# Altium schematic sheet Modules.SchDoc
size A3; DocumentNumber: 3; Revision: V1.0; SheetNumber: 3; SheetTotal: 3
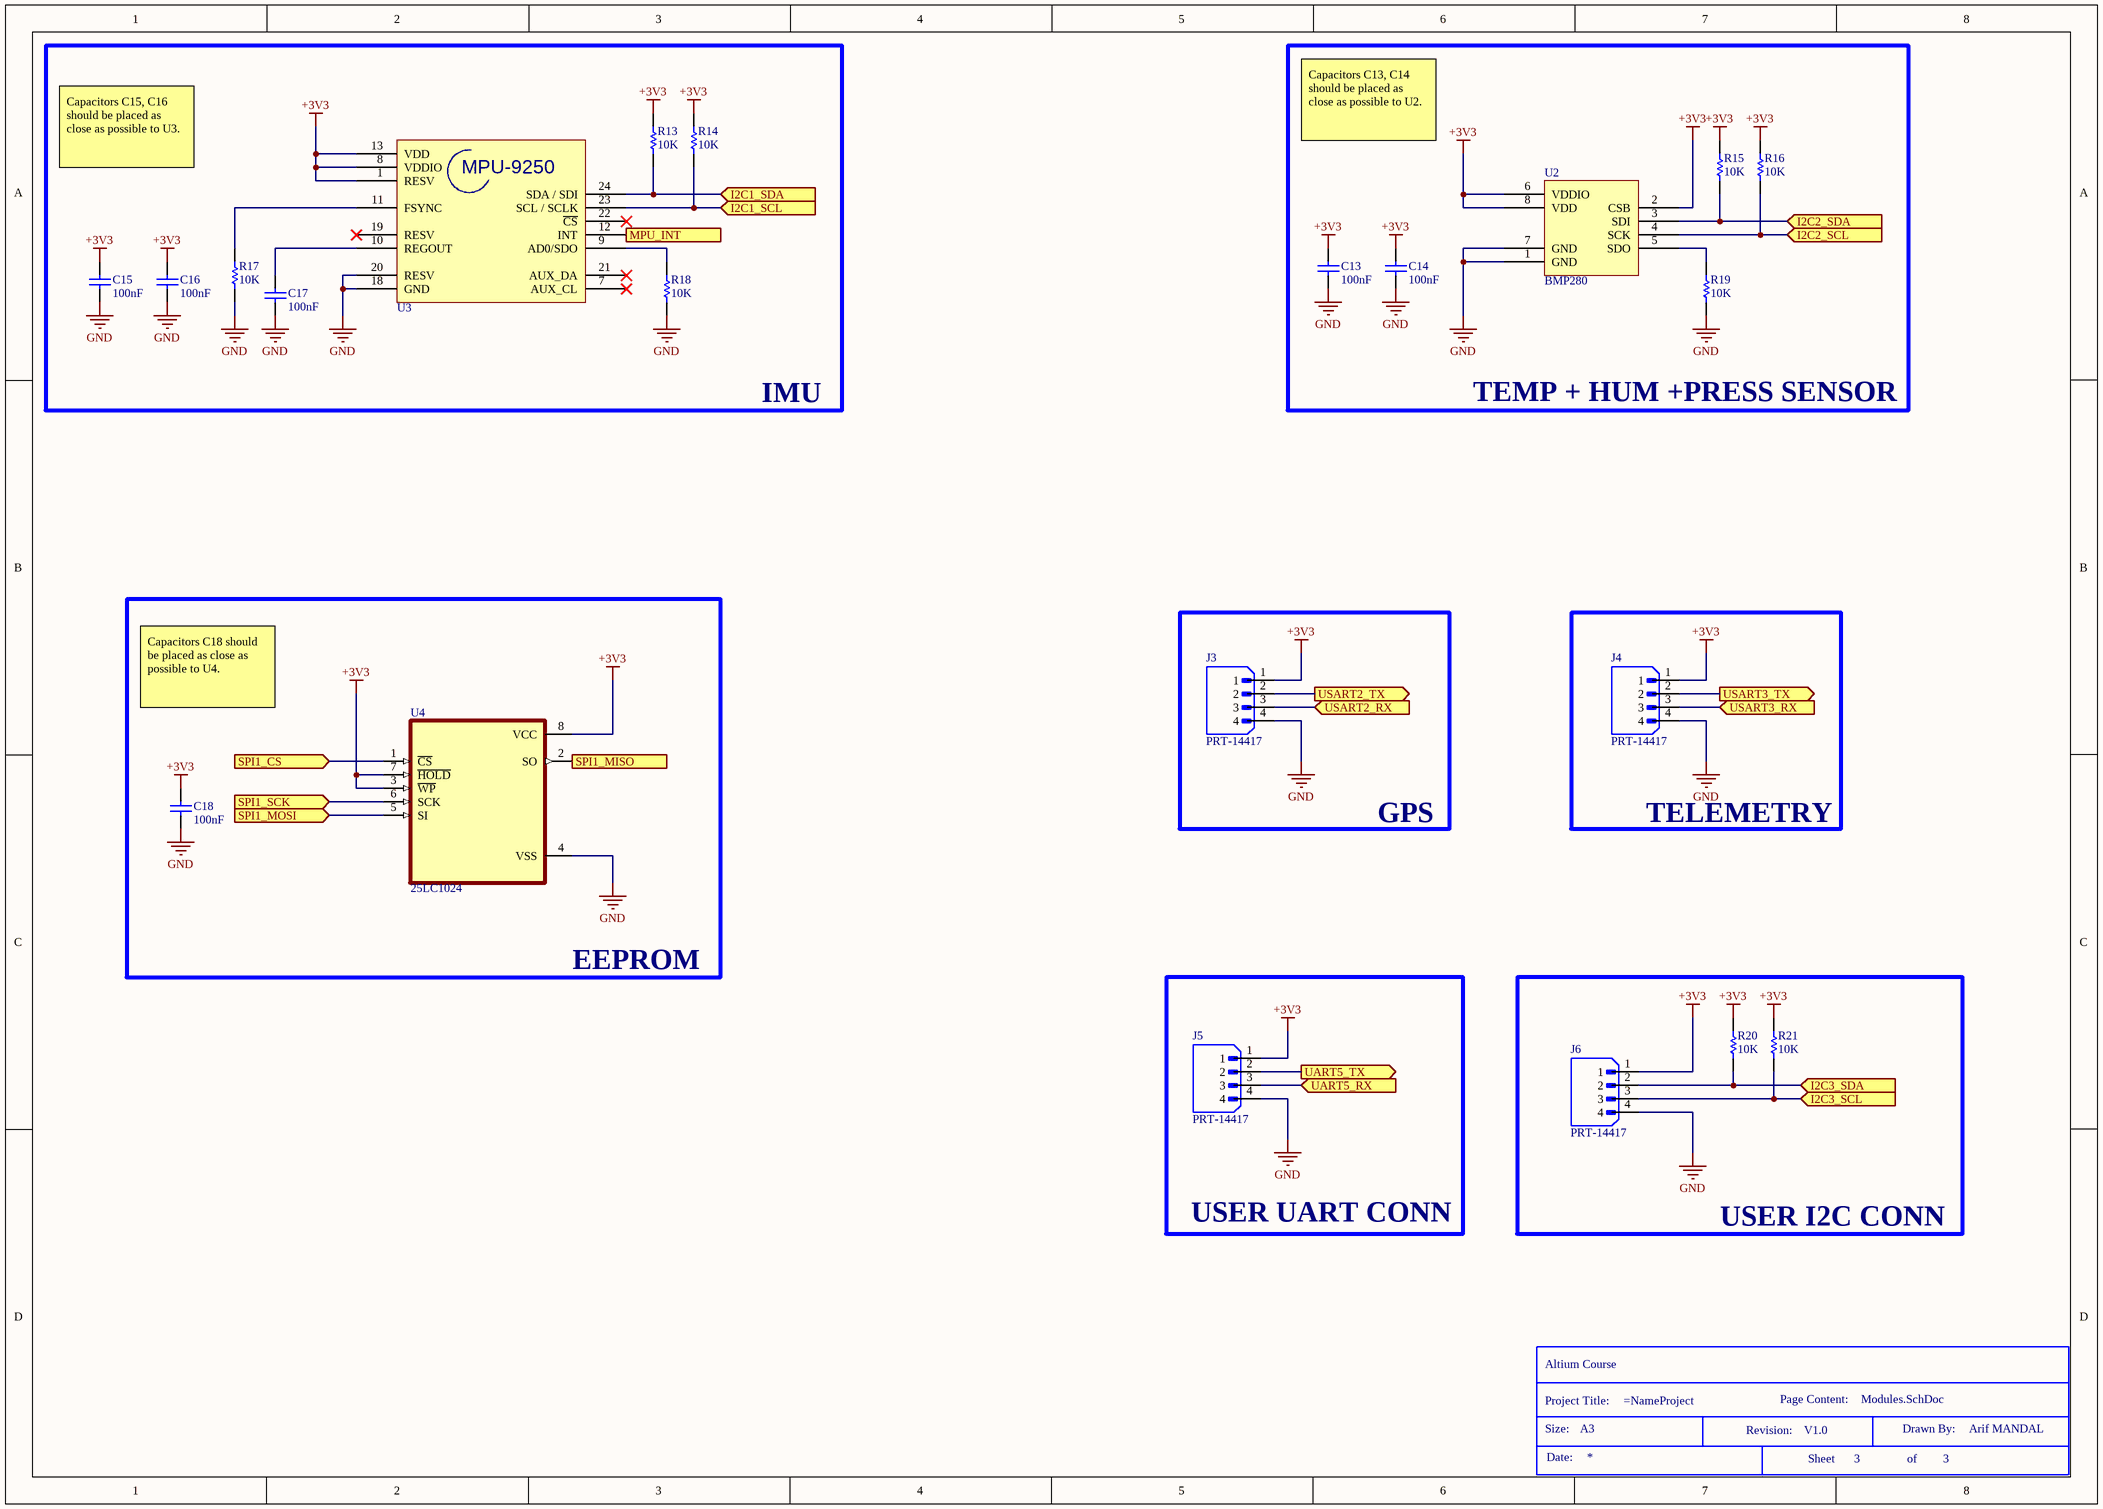
[diagram p0: Modules.SchDoc]

## Parts
*  Size: A3  Drawn By: Arif MANDAL  (hidden comment: Title Block)  (graphical)
C13  100nF  [C805]
C14  100nF  [C805]
C15  100nF  [C805]
C16  100nF  [C805]
C17  100nF  [C805]
C18  100nF  [C805]
J3  PRT-14417  [SPARKFUN_PRT-14417]
J4  PRT-14417  [SPARKFUN_PRT-14417]
J5  PRT-14417  [SPARKFUN_PRT-14417]
J6  PRT-14417  [SPARKFUN_PRT-14417]
R13  10K  [R805]
R14  10K  [R805]
R15  10K  [R805]
R16  10K  [R805]
R17  10K  [R805]
R18  10K  [R805]
R19  10K  [R805]
R20  10K  [R805]
R21  10K  [R805]
U2  BMP280  [BMP280]
U3  MPU-9250  [QFN-24]  (value not drawn)
U4  25LC1024  [SOIC-8N]

## Blocks framed on the sheet
IMU: C15-C17 R13 R14 R17 R18 U3
TEMP + HUM +PRESS SENSOR: C13 C14 R15 R16 R19 U2
EEPROM: C18 U4
GPS: J3
TELEMETRY: J4
USER UART CONN: J5
USER I2C CONN: J6 R20 R21

## Ports
I2C1_SCL (in), I2C1_SDA (in), I2C2_SCL (in), I2C2_SDA (in), I2C3_SCL (in), I2C3_SDA (in), MPU_INT (in), SPI1_CS (in), SPI1_MISO (out), SPI1_MOSI (in), SPI1_SCK (in), UART5_RX (in), UART5_TX (out), USART2_RX (in), USART2_TX (out), USART3_RX (in), USART3_TX (out)

## Nets
+3V3: C13.2 C14.2 C15.2 C16.2 C18.2 J3.1 J4.1 J5.1 J6.1 R13.2 R14.2 R15.2 R16.2 R20.2 R21.2 U2.2(CSB) U2.6(VDDIO) U2.8(VDD) U3.1(RESV) U3.8(VDDIO) U3.13(VDD) U4.3(~{WP}) U4.7(~{HOLD}) U4.8(VCC)
GND: C13.1 C14.1 C15.1 C16.1 C17.1 C18.1 J3.4 J4.4 J5.4 J6.4 R17.1 R18.1 R19.1 U2.1(GND) U2.7(GND) U3.18(GND) U3.20(RESV) U4.4(VSS)
I2C1_SCL: R14.1 U3.23(SCL_/_SCLK) ; port I2C1_SCL
I2C1_SDA: R13.1 U3.24(SDA_/_SDI) ; port I2C1_SDA
I2C2_SCL: R16.1 U2.4(SCK) ; port I2C2_SCL
I2C2_SDA: R15.1 U2.3(SDI) ; port I2C2_SDA
I2C3_SCL: J6.3 R21.1 ; port I2C3_SCL
I2C3_SDA: J6.2 R20.1 ; port I2C3_SDA
MPU_INT: U3.12(INT) ; port MPU_INT
SPI1_CS: U4.1(~{CS}) ; port SPI1_CS
SPI1_MISO: U4.2(SO) ; port SPI1_MISO
SPI1_MOSI: U4.5(SI) ; port SPI1_MOSI
SPI1_SCK: U4.6(SCK) ; port SPI1_SCK
UART5_RX: J5.3 ; port UART5_RX
UART5_TX: J5.2 ; port UART5_TX
USART2_RX: J3.3 ; port USART2_RX
USART2_TX: J3.2 ; port USART2_TX
USART3_RX: J4.3 ; port USART3_RX
USART3_TX: J4.2 ; port USART3_TX
NetC17_2: C17.2 U3.10(REGOUT)
NetR17_2: R17.2 U3.11(FSYNC)
NetR18_2: R18.2 U3.9(AD0/SDO)
NetR19_2: R19.2 U2.5(SDO)

Not connected (* = marked no-connect by the designer): U3 7(AUX_CL)* 19(RESV)* 21(AUX_DA)* 22(~{CS})*

## Notes on the sheet
- Capacitors C15, C16 should be placed as close as possible to U3.
- Capacitors C13, C14 should be placed as close as possible to U2.
- Capacitors C18 should be placed as close as possible to U4.
- (in symbol Title Block) Altium Course; Project Title:; Page Content:; Size:; Revision:; Drawn By:; Date:; Sheet; of

## Library data of the parts
C13-C18 = Cap: Capacitor; Designer: Parsa Malekpour; Value: 100nF
J3-J6 = PRT-14417: QWIIC JST CONNECTOR - SMD 4-PIN; MF: SparkFun Electronics; SnapEDA_Link: https://www.snapeda.com/parts/PRT-14417/SparkFun+Electronics/view-part/?ref=snap; Package: None; Value: *; MP: PRT-14417; Check_prices: https://www.snapeda.com/parts/PRT-14417/SparkFun+Electronics/view-part/?ref=eda
R13-R21 = Resistor: Designer: Parsa Malekpour; Value: 10K
U2 = BMP280: Digital Pressure Sensor
U4 = 25LC1024: EEPROM Memory IC 1Mb _128K x 8_ SPI 20MHz 8-SOIJ; MP: 25LC1024-I/SM; MF: Microchip; Price: None; SnapEDA_Link: https://www.snapeda.com/parts/25LC1024-I/SM/Microchip/view-part/223975/?ref=snap; Package: SOIC-8 Microchip; Value: *; Availability: Unavailable